# EasyEDA Pro project UpperMotor_v1_0_2.eprj

# Schematic Schematic1
Board Name: Board1; Create Date: 2025-05-16; Page Name: P1; Project Name: UpperMotor; Schematic Name: Schematic1; Update Date: 2025-05-17; Company: 嘉立创EDA; Drawed: 王大智; Page Size: A4; Version: V1.0
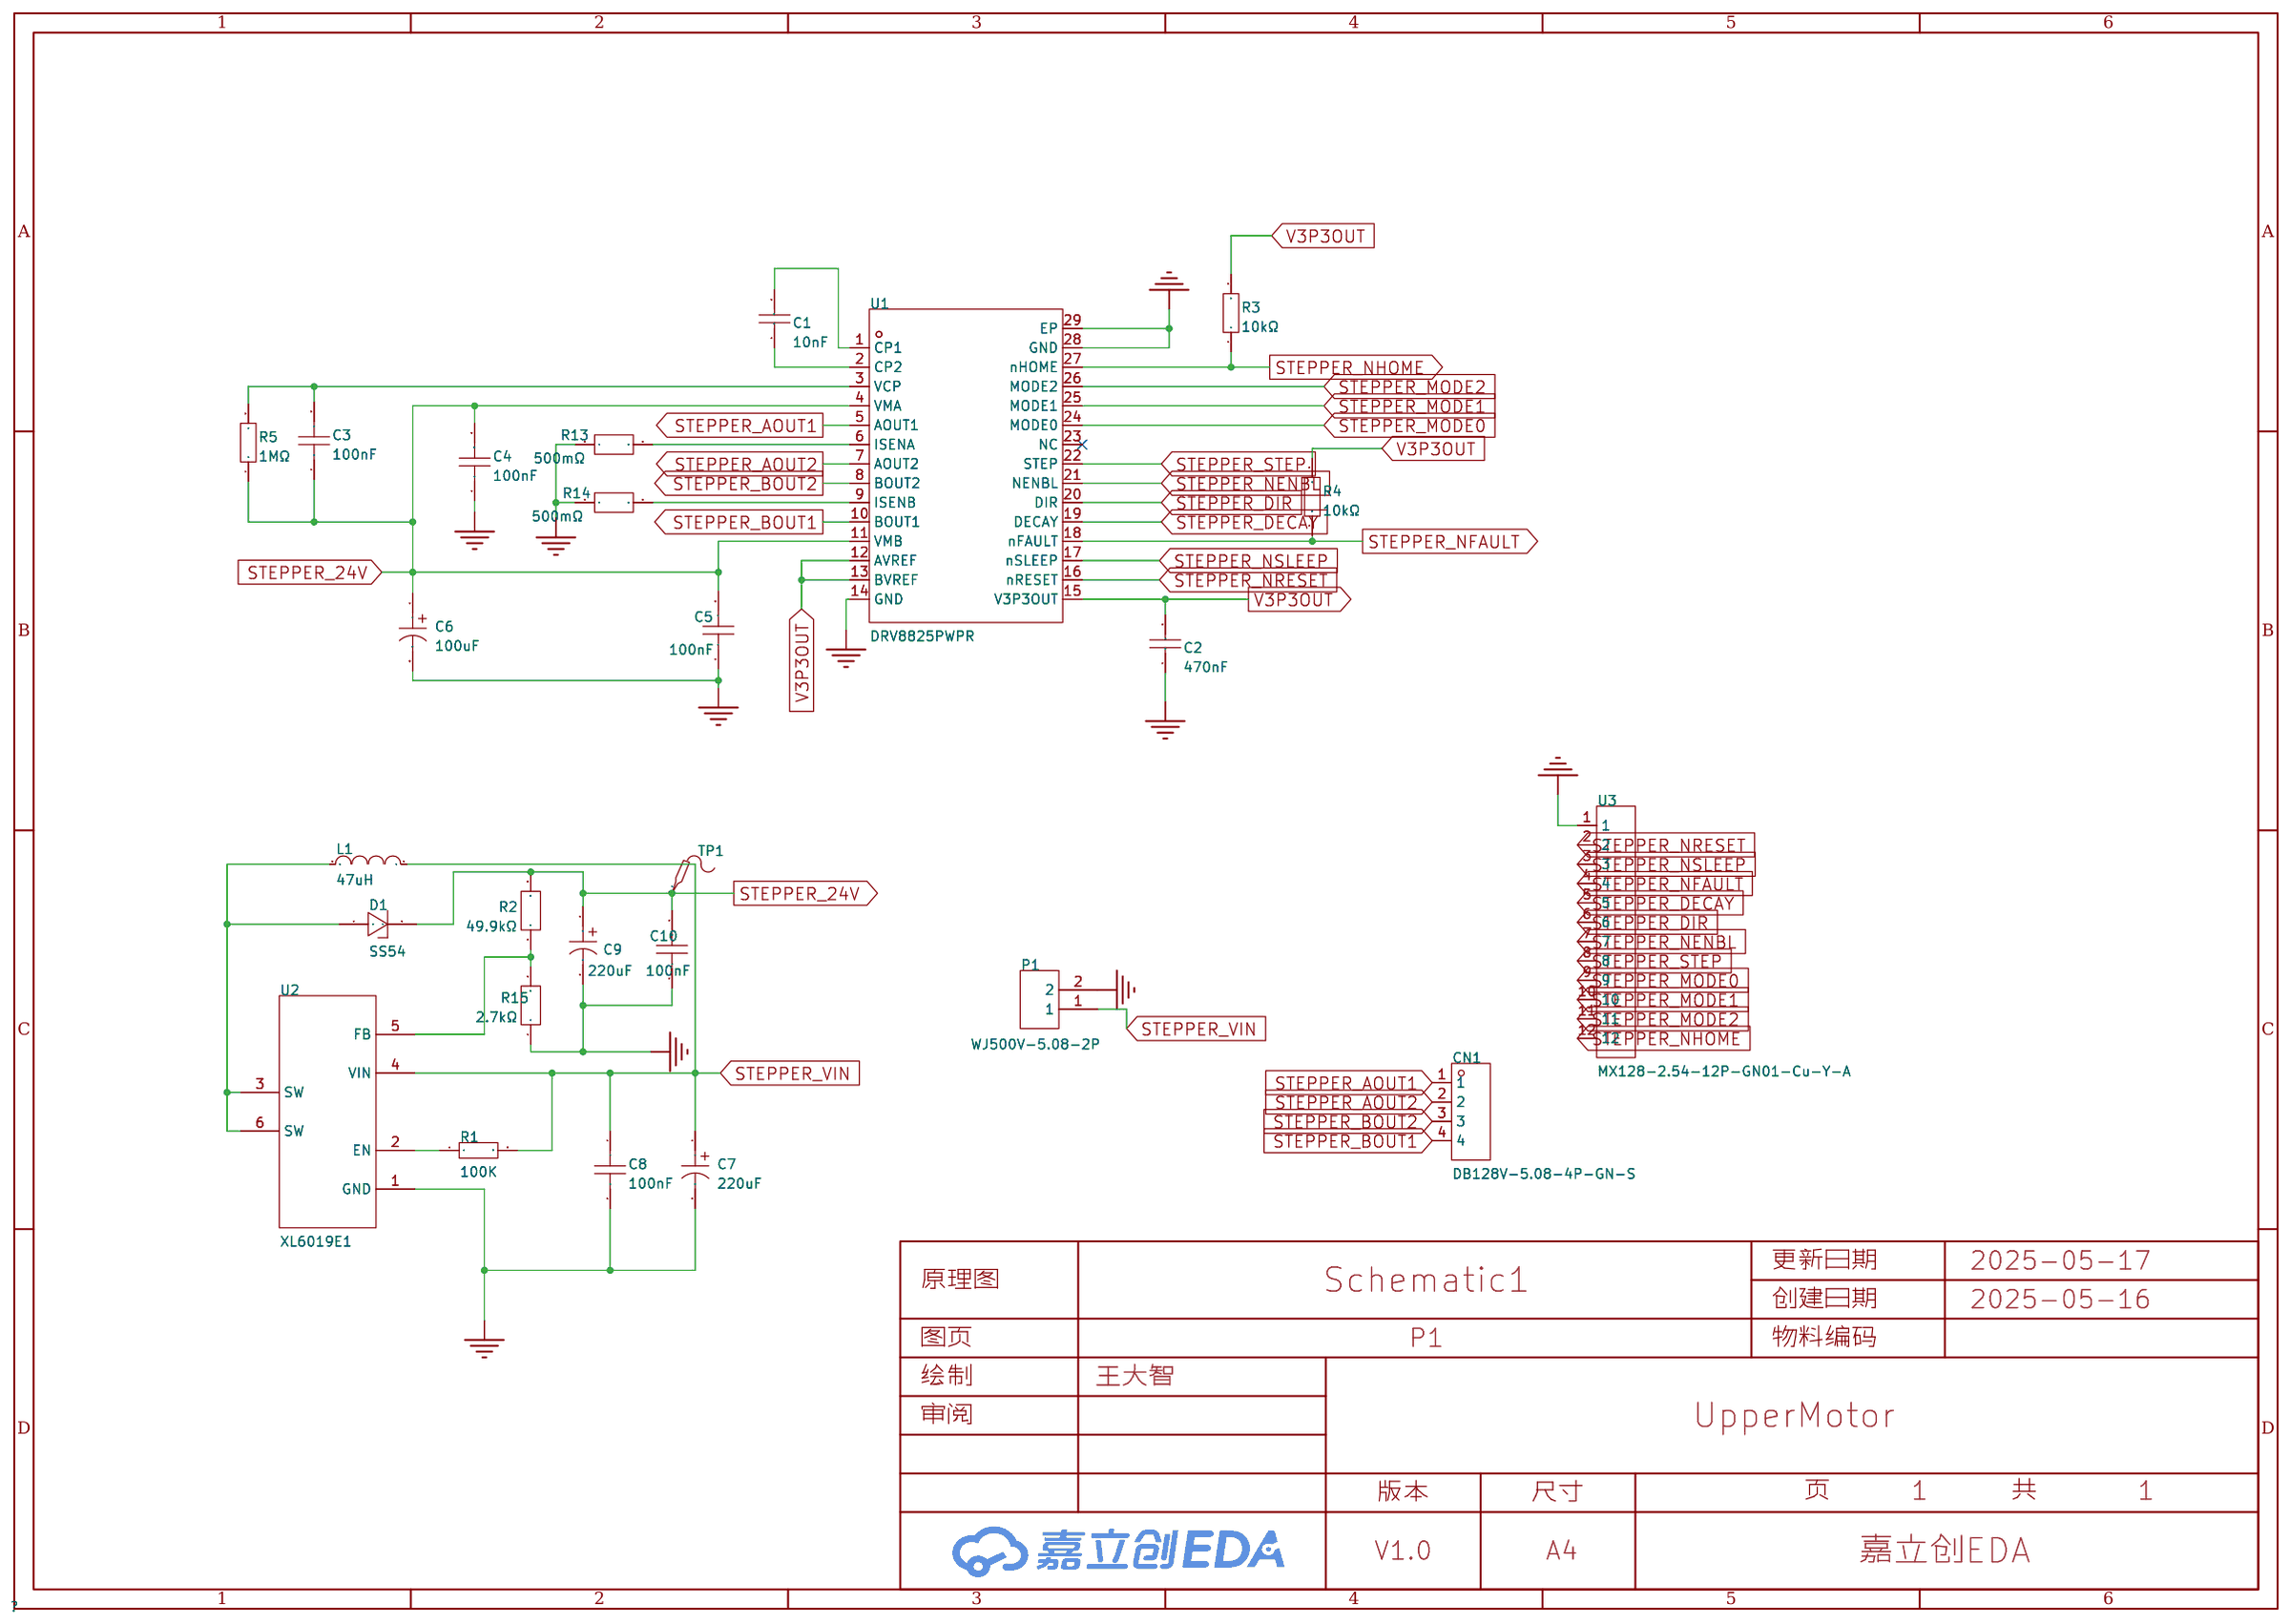
[diagram p0: schematic sheet]

## Parts
C1  10nF  [C0603]
C2  470nF  [C0603]
C3  100nF  [C0603]
C4  100nF  [C0603]
C5  100nF  [C0603]
C6  100uF  [CAP-SMD_BD8.1-L8.3-W8.3-LS9.3-FD]
C7  220uF  [CAP-SMD_BD8.0-L8.3-W8.3-FD]
C8  100nF  [C0603]
C9  220uF  [CAP-SMD_BD8.0-L8.3-W8.3-FD]
C10  100nF  [C0603]
CN1  DB128V-5.08-4P-GN-S  [CONN-TH_4P-P5.08_DIBO_DB128V-5.08]
D1  SS54  [SMA_L4.3-W2.6-LS5.0-FD]
L1  47uH  [IND-SMD_L11.5-W10.0_SMMS1040]
P1  WJ500V-5.08-2P  [CONN-TH_2P-P5.00_WJ500V-5.08-2P]
R1  100K  [R0603]
R2  49.9kΩ  [R0603]
R3  10kΩ  [R0603]
R4  10kΩ  [R0603]
R5  1MΩ  [R0603]
R13  500mΩ  [R0603]
R14  500mΩ  [R0603]
R15  2.7kΩ  [R0603]
TP1  -  [Test-Point-0.5mm]
U1  DRV8825PWPR  [HTSSOP-28_L9.7-W4.4-P0.65-LS6.4-BL-EP]
U2  XL6019E1  [TO-263-5_L10.2-W9.9-P1.70-LS14.4-TL]
U3  MX128-2.54-12P-GN01-Cu-Y-A  [CONN-TH_12P-P2.54_MX128-2.54-12P-GN01-CU-Y-A]

## Library data of the parts
C1 = CL10B103KB8NNNC: 容值:10nF;精度:±10%;额定电压:50V;材质(温度系数):X7R;; LCSC Part Name: 10nF ±10% 50V; Supplier Part: C1589; Manufacturer: SAMSUNG(三星); Supplier Footprint: 0603; JLCPCB Part Class: 扩展库; Datasheet: https://atta.szlcsc.com/upload/public/pdf/source/20160218/1457707763339.pdf; Supplier: LCSC; Tolerance: ±10%; Voltage Rated: 50V; Temperature Coefficient: X7R
C2 = CL10B474KA8NNNC: 容值:470nF;精度:±10%;额定电压:25V;材质(温度系数):X7R;; LCSC Part Name: 470nF ±10% 25V; Supplier Part: C1623; Manufacturer: SAMSUNG(三星); Supplier Footprint: 0603; JLCPCB Part Class: 基础库; Datasheet: https://atta.szlcsc.com/upload/public/pdf/source/20160218/1457707763339.pdf; Supplier: LCSC; Tolerance: ±10%; Voltage Rated: 25V; Temperature Coefficient: X7R
C3-C5 = CGA0603X7R104K500JT: 容值:100nF;精度:±10%;额定电压:50V;温度系数:X7R;; LCSC Part Name: 100nF ±10% 50V; Supplier Part: C6119867; Manufacturer: HRE(芯声); Supplier Footprint: 0603; JLCPCB Part Class: 扩展库; Datasheet: https://atta.szlcsc.com/upload/public/pdf/source/20250103/C44077DA9E7B3EFAE02F22B6D3D1CBC9.pdf; Supplier: LCSC; Tolerance: ±10%; Voltage Rating: 50V; Temperature Coefficient: X7R
C6 = GVE1H107M0810CNVC: 容值:100uF;精度:±20%;额定电压:50V;纹波电流:300mA@100kHz;等效串联电阻:600mΩ@100kHz;; LCSC Part Name: 100uF ±20% 50V; Supplier Part: C2983307; Manufacturer: HRK(鸿瑞凯电子); Supplier Footprint: SMD,D8xL10.5mm; JLCPCB Part Class: 扩展库; Datasheet: https://atta.szlcsc.com/upload/public/pdf/source/20220321/B5A059027F69866A3EEEBC781A889613.pdf; Supplier: LCSC; Tolerance: ±20%; Rated Voltage: 50V; Ripple Current: 300mA@100kHz; Equivalent Series Resistance(ESR): 600mΩ@100kHz; φD: 8mm; L: 10.5mm; Lifetime @ Temp: 2000hrs@105℃; Operating Temperature: -55℃~+105℃
C7 C9 = GVT1V227M0810CNVC: 容值:220uF;精度:±20%;额定电压:35V;纹波电流:175mA@120Hz;; LCSC Part Name: 220uF ±20% 35V; Supplier Part: C2983323; Manufacturer: HRK(鸿瑞凯电子); Supplier Footprint: SMD,D8xL10.5mm; JLCPCB Part Class: 扩展库; Datasheet: https://atta.szlcsc.com/upload/public/pdf/source/20220321/BA17E910A44EA2B508CDD6AB8BA576BA.pdf; Supplier: LCSC; Tolerance: ±20%; Rated Voltage: 35V; Ripple Current: 175mA@120Hz; φD: 8mm; L: 10.5mm; Lifetime @ Temp: 2000hrs@105℃; Operating Temperature: -55℃~+105℃
C8 C10 = CAP_0603: Supplier Footprint: 0603
CN1 = DB128V-5.08-4P-GN-S: 结构:1x4P;间距:5.08mm;颜色:绿色;安装方式:直插;排数:1;每排PIN数:4;额定电流:16A;额定电压:300V;线规 - AWG:12~22;线规 - 平方毫米:2.5;工作温度:-40℃~+105℃;; LCSC Part Name: 1x4P 5.08mm 直插 排数:1 每排P数:4; Supplier Part: C2915641; Manufacturer: DORABO(地博电气); Supplier Footprint: 插件,P=5.08mm; JLCPCB Part Class: 扩展库; Datasheet: https://atta.szlcsc.com/upload/public/pdf/source/20230106/CC449C10514519CDCE20F1C37DBF2DAC.pdf; Supplier: LCSC; Number of Positions or Pins: 1x4P; Pitch: 5.08mm; Color: 绿色; Mounting Type: 直插; Number of Pins: 4P; Number of Rows: 1; Number of PINs Per Row: 4; Screw Specification: M2.5; Current Rating: 16A; Voltage Rating (Max): 300V; Wire Gauge - AWG: 12~22; Wire Gauge - mm2: 2.5; Operating Temperature: -40℃~+105℃
D1 = SS54_C7420369: 二极管配置:独立式;正向压降(Vf):550mV@5.0A;直流反向耐压(Vr):40V;整流电流:5A;; LCSC Part Name: 电压:40V 电流:5A; Supplier Part: C7420369; Manufacturer: 宏迦橙; Supplier Footprint: SMA(DO-214AC); JLCPCB Part Class: 扩展库; Datasheet: https://atta.szlcsc.com/upload/public/pdf/source/20230828/254C3882F8647358AD9F60DD73611B5E.pdf; Supplier: LCSC; Diode Configuration: 独立式; Forward Voltage (Vf@If): 550mV@5.0A; Reverse Voltage (Vr): 40V; Rectified Current: 5A; Reverse Leakage Current (Ir): 50uA@40V
L1 = SMMS1040-470M: 电感值:47uH;精度:±20%;额定电流:3A;饱和电流(Isat):4.5A;类型:一体成型电感;; LCSC Part Name: 47uH ±20% 4.5A; Supplier Part: C149599; Manufacturer: SXN(顺翔诺); JLCPCB Part Class: 扩展库; Datasheet: https://atta.szlcsc.com/upload/public/pdf/source/20210810/BBF24330FB2F5029F637830BA9C42C0D.pdf; Supplier: LCSC; Tolerance: ±20%; Rated Current: 3A; Saturation Current (Isat): 4.5A; DC Resistance (DCR): 155mΩ; Type: 一体成型电感
P1 = WJ500V-5.08-2P: 结构:1x2P;间距:5.08mm;颜色:绿色;安装方式:直插;额定电流:18A;额定电压:250V;排数:1;线规 - AWG:14~30;线规 - 平方毫米:2.5;每排PIN数:2;触头材质:-;触头镀层:-;工作温度范围:-40℃~+105℃;焊接温度(最大值):-;; LCSC Part Name: 1x2P 5.08mm 直插 排数:1 每排P数:2; Supplier Part: C8465; Manufacturer: KANGNEX(康奈克斯电气); Supplier Footprint: 插件,P=5.08mm; JLCPCB Part Class: 扩展库; Datasheet: https://atta.szlcsc.com/upload/public/pdf/source/20191225/C8465_02D34CE5B5B4A53DF5891601D97FA9F4.pdf; Supplier: LCSC; Structure: 1x2P; Pitch: 5.08mm; Color: 绿色; Mounting Style: 直插; Current Rating (Max): 18A; Voltage Rating (Max): 250V; Number of Pins: 2P; Number of Rows: 1; Wire Gauge - AWG: 14~30; Wire Gauge - mm2: 2.5; Number of PINs Per Row: 2; Operating Temperature Range: -40℃~+105℃; Screw Specification: M2.5
R1 = Res_0603: Supplier Footprint: 0603
R2 = FRC0603F4992TS: 电阻类型:厚膜电阻;阻值:49.9kΩ;精度:±1%;功率:100mW;最大工作电压:75V;温度系数:±100ppm/℃;; LCSC Part Name: 49.9kΩ ±1% 100mW 厚膜电阻; Supplier Part: C2930109; Manufacturer: FOJAN(富捷); Supplier Footprint: 0603; JLCPCB Part Class: 扩展库; Datasheet: https://atta.szlcsc.com/upload/public/pdf/source/20211221/925EC7D7225764EE0046F22065062C87.pdf; Supplier: LCSC; Type: 厚膜电阻; Tolerance: ±1%; Power(Watts): 100mW; Overload Voltage (Max): 75V; Temperature Coefficient: ±100ppm/℃; Operating Temperature Range: -55℃~+155℃
R3 R4 = RC0603FR-0710KL: 电阻类型:厚膜电阻;阻值:10kΩ;精度:±1%;功率:100mW;最大工作电压:75V;温度系数:±100ppm/℃;; LCSC Part Name: 厚膜电阻 10kΩ ±1% 100mW; Supplier Part: C98220; Manufacturer: YAGEO(国巨); Supplier Footprint: 0603; JLCPCB Part Class: 扩展库; Datasheet: https://atta.szlcsc.com/upload/public/pdf/source/20180927/C295883_E8D83085EA81BD7DE0B2B681138C15EE.pdf; Supplier: LCSC; Type: 厚膜电阻; Tolerance: ±1%; Power(Watts): 100mW; Overload Voltage (Max): 75V; Temperature Coefficient: ±100ppm/℃; Operating Temperature Range: -55℃~+155℃
R5 = 0603WAF1004T5E: 电阻类型:厚膜电阻;阻值:1MΩ;精度:±1%;功率:100mW;最大工作电压:75V;温度系数:±100ppm/℃;; LCSC Part Name: 1MΩ ±1% 100mW 厚膜电阻; Supplier Part: C22935; Manufacturer: UNI-ROYAL(厚声); Supplier Footprint: 0603; JLCPCB Part Class: Basic Part; Datasheet: https://atta.szlcsc.com/upload/public/pdf/source/20200306/C422600_1E6D84923E4A46A82E41ADD87F860B5C.pdf; Supplier: LCSC; Type: 厚膜电阻; Tolerance: ±1%; Power(Watts): 100mW; Overload Voltage (Max): 75V; Temperature Coefficient: ±100ppm/℃; Operating Temperature Range: -55℃~+155℃
R13 R14 = FRL0603JR500TS: 电阻类型:厚膜电阻;阻值:500mΩ;精度:±5%;功率:100mW;最大工作电压:100V;温度系数:±300ppm/℃;; LCSC Part Name: 500mΩ ±5% 100mW 厚膜电阻; Supplier Part: C2930046; Manufacturer: FOJAN(富捷); Supplier Footprint: 0603; JLCPCB Part Class: 扩展库; Datasheet: https://atta.szlcsc.com/upload/public/pdf/source/20211221/925EC7D7225764EE0046F22065062C87.pdf; Supplier: LCSC; Type: 厚膜电阻; Tolerance: ±5%; Power(Watts): 100mW; Overload Voltage (Max): 100V; Temperature Coefficient: ±300ppm/℃; Operating Temperature Range: -55℃~+155℃
R15 = FRC0603F2701TS: 电阻类型:厚膜电阻;阻值:2.7kΩ;精度:±1%;功率:100mW;工作电压:75V;温度系数:±100ppm/℃;; LCSC Part Name: 2.7kΩ ±1% 100mW 厚膜电阻; Supplier Part: C2907008; Manufacturer: FOJAN(富捷); Supplier Footprint: 0603; JLCPCB Part Class: 扩展库; Datasheet: https://atta.szlcsc.com/upload/public/pdf/source/20211221/925EC7D7225764EE0046F22065062C87.pdf; Supplier: LCSC; Type: 厚膜电阻; Tolerance: ±1%; Power(Watts): 100mW; Voltage-Supply(Max): 75V; Temperature Coefficient: ±100ppm/℃; Operating Temperature: -55℃~+155℃
TP1 = Test-Point: Test Point 测试点
U1 = DRV8825PWPR: DRV8825 具有电流调节功能和 1/32 微步进的 45V、2.5A 双极步进电机驱动器; LCSC Part Name: 2.5A 45V电机驱动芯片; Supplier Part: C81582; Manufacturer: TI(德州仪器); Supplier Footprint: HTSSOP-28-EP; JLCPCB Part Class: 扩展库; Datasheet: https://www.ti.com/cn/lit/gpn/drv8825; Supplier: LCSC
U2 = XL6019E1: 功能类型:升降压型;输出类型:可调;工作电压:5V~40V;输出电压:-;输出电流:5A;; LCSC Part Name: 180KHz 60V 5A开关电流升压/升降压型DC-DC转换器; Supplier Part: C73018; Manufacturer: XLSEMI(芯龙); Supplier Footprint: TO-263-5; JLCPCB Part Class: 扩展库; Datasheet: https://atta.szlcsc.com/upload/public/pdf/source/20230915/0F37A40A07D65557F92F701F29EBE038.pdf; Supplier: LCSC; Function: 升降压型; Output Type: 可调; Input Voltage: 5V~40V; Output Current: 5A; Switching Frequency: 180kHz; Operating Temperature: -40℃~+125℃; Synchronous Rectification: 是; Number of Outputs: 1; Topology: 反相式; Quiescent Current (Iq): 2.5mA; Switch tube (built-in/external): 内置
U3 = MX128-2.54-12P-GN01-Cu-Y-A: 结构:1x12P;间距:2.54mm;颜色:绿色;安装方式:直插;排数:1;每排PIN数:12;额定电流:6A;额定电压:150V;线规 - AWG:18~24;线规 - 平方毫米:1;工作温度:-40℃~+105℃;; LCSC Part Name: 1x12P 2.54mm 直插 排数:1 每排P数:12; Supplier Part: C5188451; Manufacturer: MAX(迈旭); Supplier Footprint: 插件,P=2.54mm; JLCPCB Part Class: 扩展库; Datasheet: https://atta.szlcsc.com/upload/public/pdf/source/20250320/39CF67EAC718F5AC600D0D1AE915BA0E.pdf; Supplier: LCSC; Number of Positions or Pins: 1x12P; Pitch: 2.54mm; Color: 绿色; Mounting Type: 直插; Number of Pins: 12P; Number of Rows: 1; Number of PINs Per Row: 12; Screw Specification: M1.6; Current Rating: 6A; Voltage Rating (Max): 150V; Wire Gauge - AWG: 18~24; Wire Gauge - mm2: 1; Operating Temperature: -40℃~+105℃

## Nets
GND: C2.1 C4.1 C5.1 C6.2 C7.2 C8.2 C9.2 C10.1 P1.2 R13.1 R14.1 R15.1 U1.14(GND) U1.28(GND) U1.29(EP) U2.1(GND) U3.1
V3P3OUT: C2.2 R3.2 R4.2 U1.12(AVREF) U1.13(BVREF) U1.15(V3P3OUT)
STEPPER_24V: C3.1 C4.2 C5.2 C6.1 C9.1 C10.2 D1.2(K) R2.2 R5.1 TP1.1 U1.4(VMA) U1.11(VMB)
STEPPER_AOUT1: CN1.1 U1.5(AOUT1)
STEPPER_AOUT2: CN1.2 U1.7(AOUT2)
STEPPER_BOUT1: CN1.4 U1.10(BOUT1)
STEPPER_BOUT2: CN1.3 U1.8(BOUT2)
STEPPER_DECAY: U1.19(DECAY) U3.5
STEPPER_DIR: U1.20(DIR) U3.6
STEPPER_MODE0: U1.24(MODE0) U3.9
STEPPER_MODE1: U1.25(MODE1) U3.10
STEPPER_MODE2: U1.26(MODE2) U3.11
STEPPER_NENBL: U1.21(NENBL) U3.7
STEPPER_NFAULT: R4.1 U1.18(nFAULT) U3.4
STEPPER_NHOME: R3.1 U1.27(nHOME) U3.12
STEPPER_NRESET: U1.16(nRESET) U3.2
STEPPER_NSLEEP: U1.17(nSLEEP) U3.3
STEPPER_STEP: U1.22(STEP) U3.8
STEPPER_VIN: C7.1 C8.1 L1.2 P1.1 R1.2 U2.4(VIN)
$1N829: C1.1 U1.2(CP2)
$1N830: C1.2 U1.1(CP1)
$1N833: R13.2 U1.6(ISENA)
$1N834: R14.2 U1.9(ISENB)
$1N856: C3.2 R5.2 U1.3(VCP)
$1N1708: R1.1 U2.2(EN)
$1N1709: R2.1 R15.2 U2.5(FB)
$1N1711: D1.1(A) L1.1 U2.3(SW) U2.6(SW)

Not connected (* = marked no-connect by the designer): U1 23(NC)*

# Board PCB1
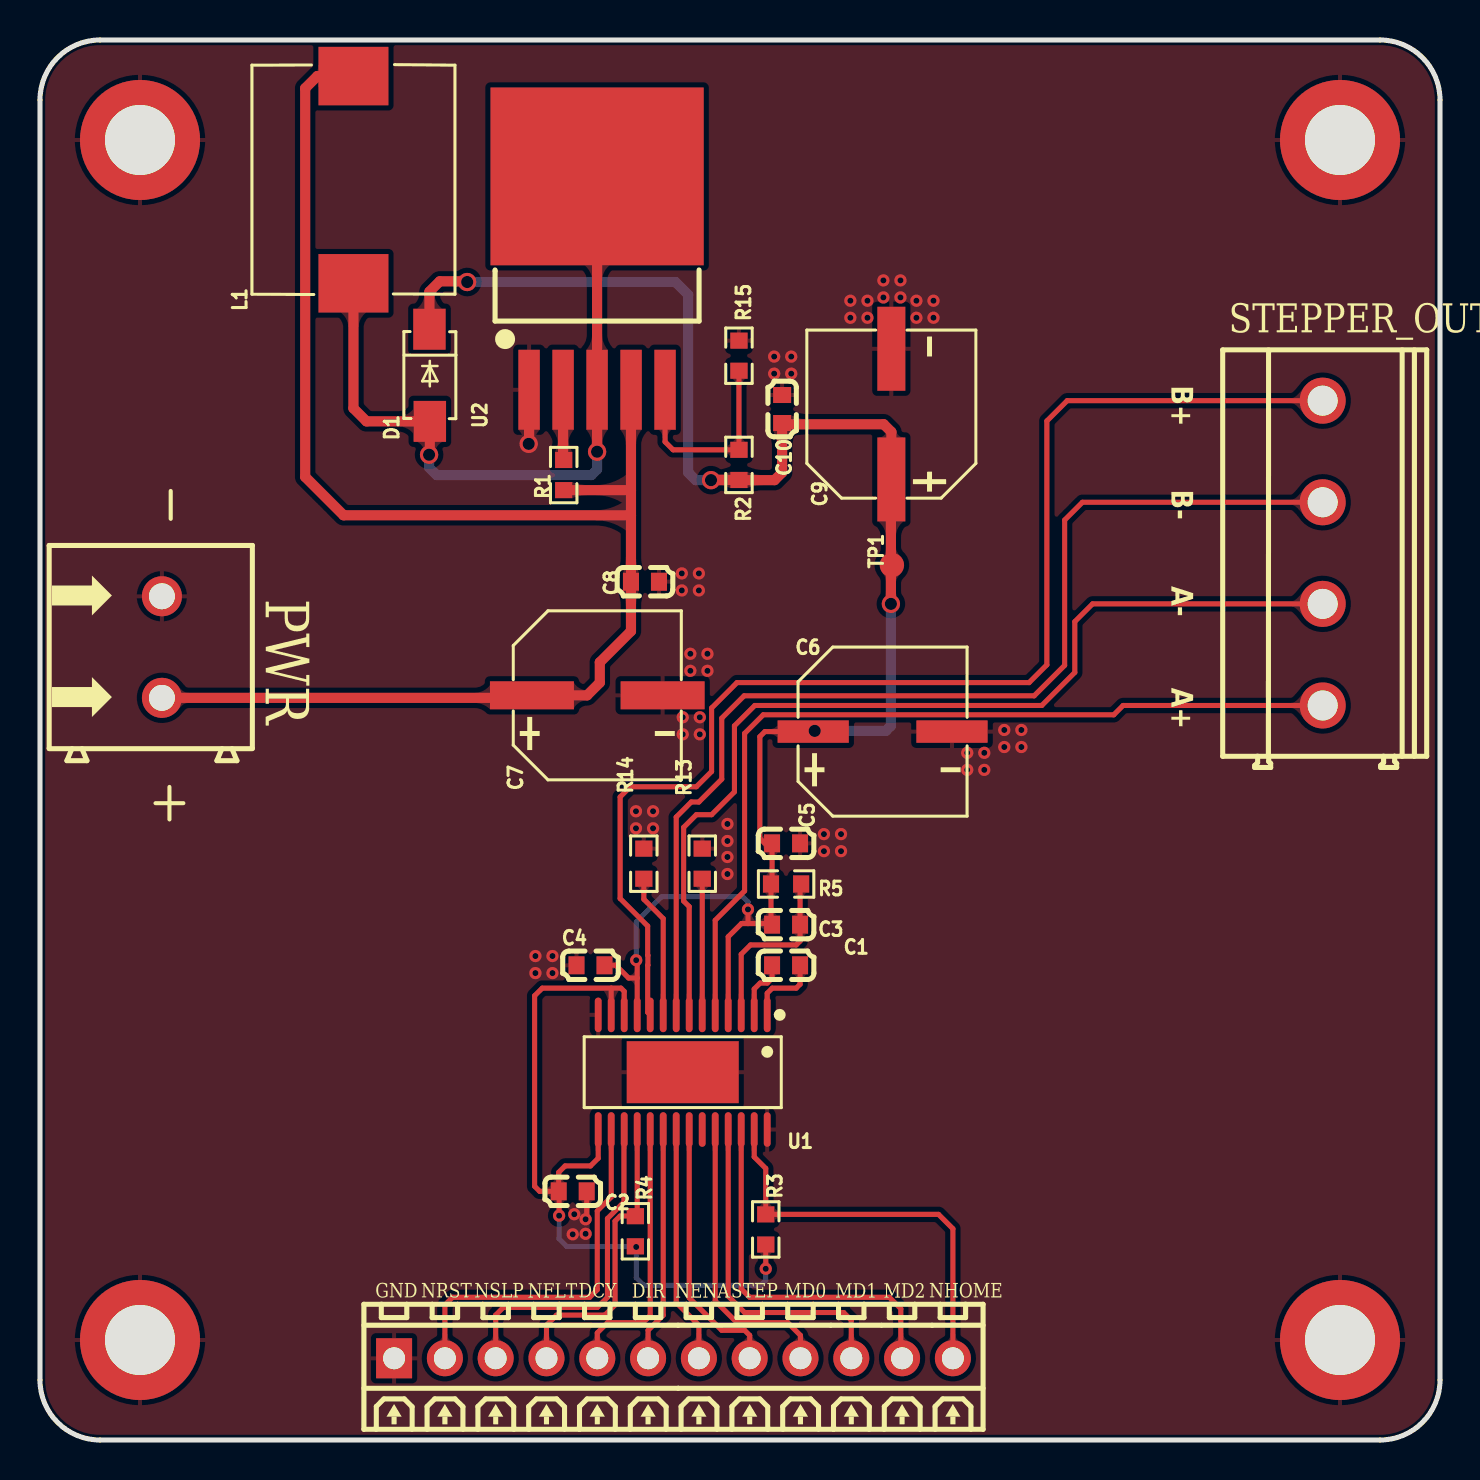
[diagram p1: board, top side]
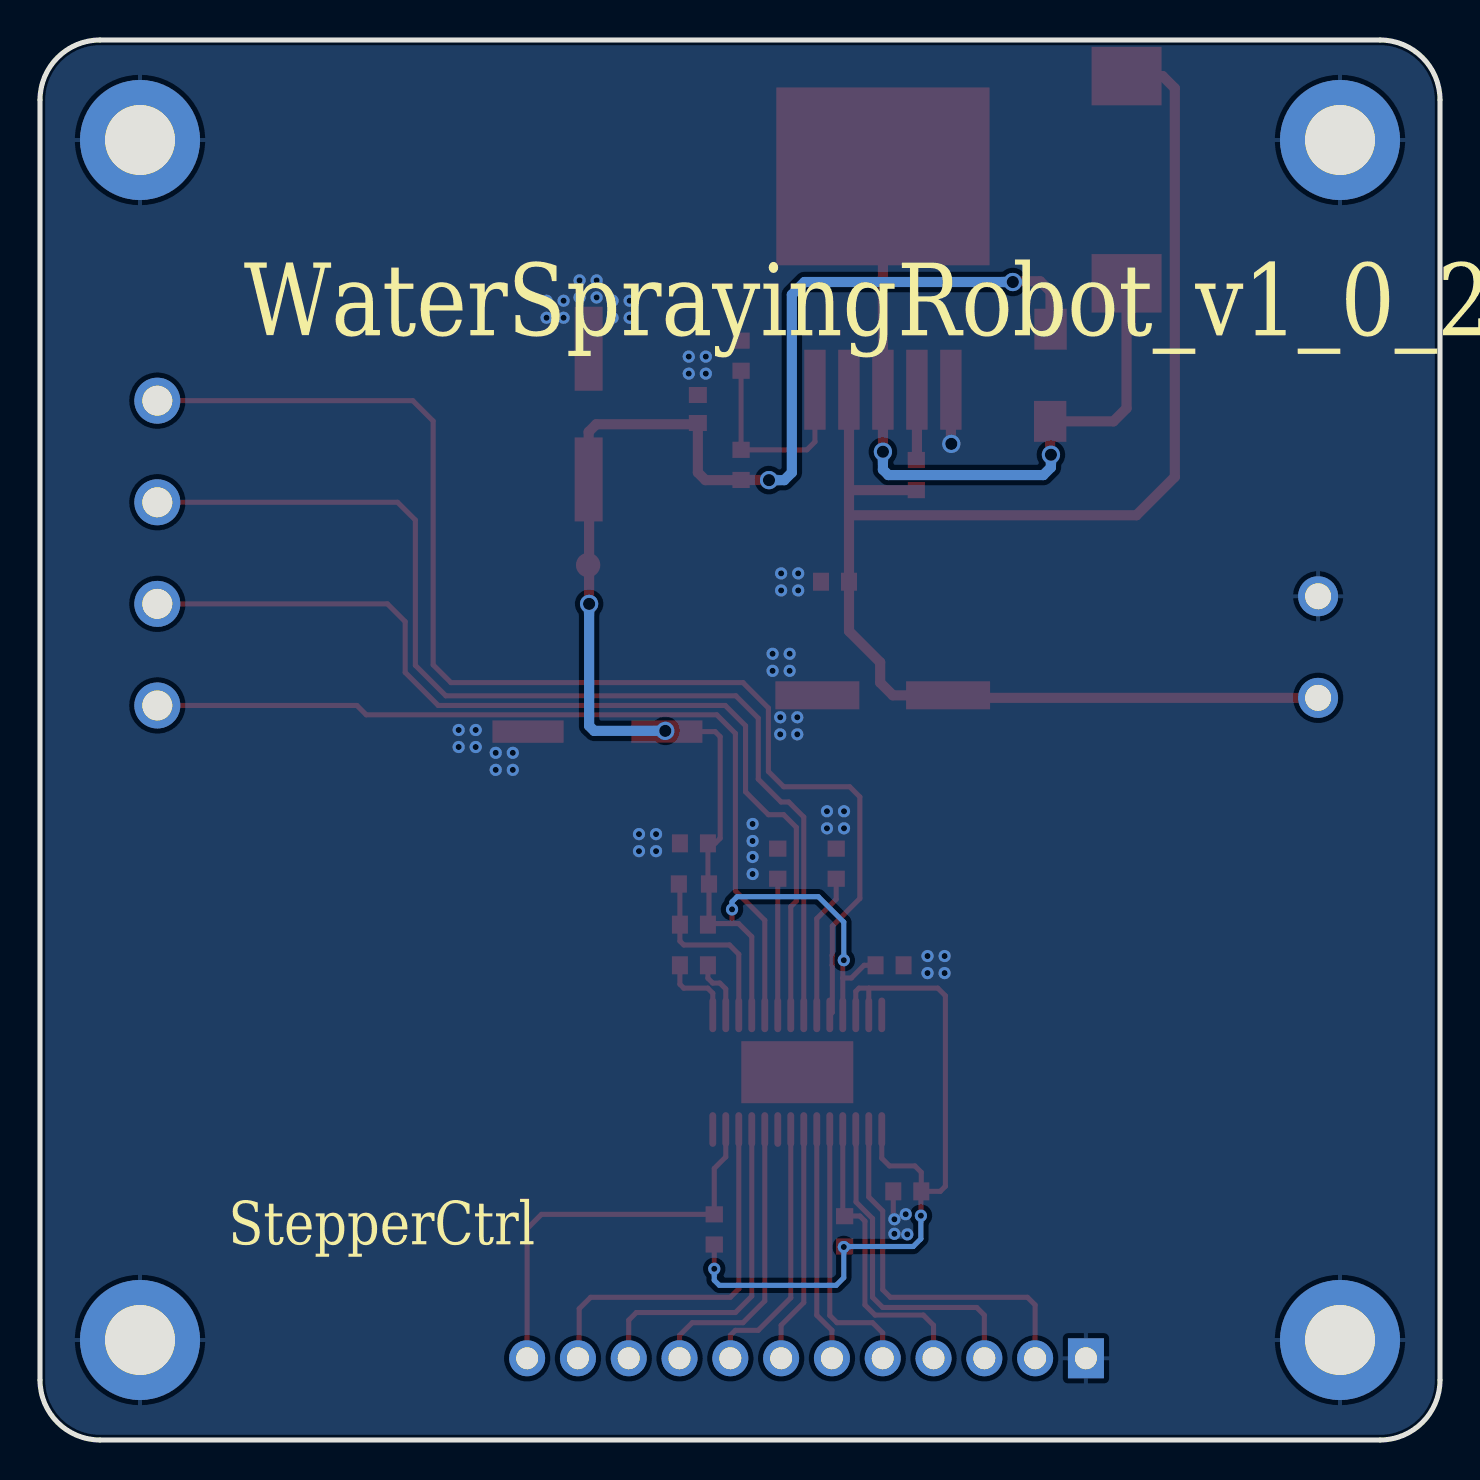
[diagram p2: board, bottom side, seen from below]

Outline 70 x 70 mm; copper layers: Top Layer, Bottom Layer. Coordinates in mm from the lower left corner of the outline.
Outline path: 0,67 0,3 arc(0.88,0.88) 3,0 67,0 arc(69.12,0.88) 70,3 70,67 arc(69.12,69.12) 67,70 3,70 arc(0.88,69.12) 0,67
Stack: Top Layer 0.035mm / Dielectric1 1.51mm FR4 er 4.5 / Bottom Layer 0.035mm

## Design rules (mm)
template: JLCPCB Capability(Two Layers Board)
spacing copperThickness1oz (default): track to track 0.102, other pairs 0.152 to 0.3
spacing copperThickness2oz: track to track 0.203, other pairs 0.152 to 0.3
track width copperThickness1oz (default): min 0.127, default 0.254, max 2.54
track width copperThickness2oz: min 0.203, default 0.254, max 2.54
differential pair differentialPair (default): width min 0.127, default 0.254, max 2.54; gap min 0.152, default 0.152
via viaSize (default): diameter min 0.5, default 0.61, max 10; hole min 0.3, default 0.305, max 6.3

## Placement (name value [footprint] x y rotation side)
C1  10nF  [C0603]  37.3 23.74 0 top
C2  470nF  [C0603]  26.64 12.43 180 top
C3  100nF  [C0603]  37.3 25.77 0 top
C4  100nF  [C0603]  27.52 23.74 0 top
C5  100nF  [C0603]  37.3 29.83 180 top
C6  100uF  [CAP-SMD_BD8.1-L8.3-W8.3-LS9.3-FD]  42.13 35.42 0 top
C7  220uF  [CAP-SMD_BD8.0-L8.3-W8.3-FD]  27.86 37.23 0 top
C8  100nF  [C0603]  30.25 42.91 0 top
C9  220uF  [CAP-SMD_BD8.0-L8.3-W8.3-FD]  42.57 51.3 90 top
C10  100nF  [C0603]  37.11 51.55 270 top
CN1  DB128V-5.08-4P-GN-S  [CONN-TH_4P-P5.08_DIBO_DB128V-5.08]  64.13 44.35 90 top
D1  SS54  [SMA_L4.3-W2.6-LS5.0-FD]  19.48 53.24 90 top
L1  47uH  [IND-SMD_L11.5-W10.0_SMMS1040]  15.67 63.02 90 top
NOREF  -  [Pad_e732]  5 65 0 top
NOREF#2  -  [Pad_e764]  5 5 0 top
NOREF#3  -  [Pad_e765]  65 5 0 top
NOREF#4  -  [Pad_e763]  65 65 0 top
P1  WJ500V-5.08-2P  [CONN-TH_2P-P5.00_WJ500V-5.08-2P]  6.1 39.65 90 top
R1  100K  [R0603]  26.18 48.25 270 top
R2  49.9kΩ  [R0603]  34.95 48.75 270 top
R3  10kΩ  [R0603]  36.29 10.53 270 top
R4  10kΩ  [R0603]  29.77 10.44 270 top
R5  1MΩ  [R0603]  37.3 27.8 0 top
R13  500mΩ  [R0603]  33.11 28.82 270 top
R14  500mΩ  [R0603]  30.19 28.82 270 top
R15  2.7kΩ  [R0603]  34.95 54.22 270 top
TP1  -  [Test-Point-0.5mm]  42.59 43.75 90 top
U1  DRV8825PWPR  [HTSSOP-28_L9.7-W4.4-P0.65-LS6.4-BL-EP]  32.14 18.39 180 top
U2  XL6019E1  [TO-263-5_L10.2-W9.9-P1.70-LS14.4-TL]  27.85 57.85 90 top
U3  MX128-2.54-12P-GN01-Cu-Y-A  [CONN-TH_12P-P2.54_MX128-2.54-12P-GN01-CU-Y-A]  31.67 4.09 0 top

## Footprints (pads in the part's own frame, mm; a bottom-side part is the same pattern mirrored in y, then rotated)
C0603
  rect 0.8x0.9 smd: 1(-0.7,0) 2(0.7,0)
CAP-SMD_BD8.0-L8.3-W8.3-FD
  rect 4.2x1.4 smd: 1(-3.267,0) 2(3.267,0)
CAP-SMD_BD8.1-L8.3-W8.3-LS9.3-FD
  rect 3.56x1.12 smd: 1(-3.47,0) 2(3.47,0)
CONN-TH_2P-P5.00_WJ500V-5.08-2P
  round 2 hole 1.3: 1(-2.54,0) 2(2.54,0)
CONN-TH_4P-P5.08_DIBO_DB128V-5.08
  round 2.3 hole 1.5: 1(-7.62,0) 2(-2.54,0) 3(2.54,0) 4(7.62,0)
CONN-TH_12P-P2.54_MX128-2.54-12P-GN01-CU-Y-A
  rect 1.8x2 hole 1.1: 1(-13.97,0)
  round 1.8 hole 1.1: 2(-11.43,0) 3(-8.89,0) 4(-6.35,0) 5(-3.81,0) 6(-1.27,0) 7(1.27,0) 8(3.81,0) 9(6.35,0) 10(8.89,0) 11(11.43,0) 12(13.97,0)
HTSSOP-28_L9.7-W4.4-P0.65-LS6.4-BL-EP
  oval 0.343x1.732 smd: 1(-4.225,-2.866) 2(-3.575,-2.866) 3(-2.925,-2.866) 4(-2.275,-2.866) 5(-1.625,-2.866) 6(-0.975,-2.866) 7(-0.325,-2.866) 8(0.325,-2.866) 9(0.975,-2.866) 10(1.625,-2.866) 11(2.275,-2.866) 12(2.925,-2.866) 13(3.575,-2.866) 14(4.225,-2.866) 15(4.225,2.866) 16(3.575,2.866) 17(2.925,2.866) 18(2.275,2.866) 19(1.625,2.866) 20(0.975,2.866) 21(0.325,2.866) 22(-0.325,2.866) 23(-0.975,2.866) 24(-1.625,2.866) 25(-2.275,2.866) 26(-2.925,2.866) 27(-3.575,2.866) 28(-4.225,2.866)
  rect 5.6x3.1 smd: 29(0,0)
IND-SMD_L11.5-W10.0_SMMS1040
  rect 2.924x3.5 smd: 1(-5.181,0) 2(5.181,0)
Pad_e732
  round 6 hole 3.5: 1(0,0)
Pad_e763
  round 6 hole 3.5: 1(0,0)
Pad_e764
  round 6 hole 3.5: 1(0,0)
Pad_e765
  round 6 hole 3.5: 1(0,0)
R0603
  rect 0.806x0.864 smd: 1(-0.753,0) 2(0.753,0)
SMA_L4.3-W2.6-LS5.0-FD
  rect 2.046x1.62 smd: 1(-2.304,-0.009) 2(2.304,0.009)
Test-Point-0.5mm
  round 1.219 smd: 1(0,0)
TO-263-5_L10.2-W9.9-P1.70-LS14.4-TL
  rect 4x1.069 smd: 1(-5.334,3.4) 2(-5.334,1.7) 3(-5.334,0) 4(-5.334,-1.7) 5(-5.334,-3.4)
  rect 8.89x10.66 smd: 6(5.334,0)

## Nets
As in the schematic, except:
GND: C2.1 C4.1 C5.1 C6.2 C7.2 C8.2 C9.2 C10.1 NOREF.1 NOREF#2.1 NOREF#3.1 NOREF#4.1 P1.2 R13.1 R14.1 R15.1 U1.14 U1.28 U1.29 U2.1 U3.1

Pads without a net: U1 23

## Via types
v1: diameter 0.61, hole 0.305, Top Layer to Bottom Layer, 61 vias
v2: diameter 0.914, hole 0.61, Top Layer to Bottom Layer, 7 vias

## Routing (per net, layer and track width the routed paths; a pad name or vN(x,y) marks a point on that pad's centre or on a via; arc(x,y) is an arc through that point)
GND: length 4.1
  Top Layer w0.254: C2.1 27.34,11.09 v1(27.28,11.04)
  Top Layer w0.508: U2.1 24.45,49.83 v2(24.44,49.81)
  vias: v1(24.77,24.2) v1(24.77,23.35) v1(25.62,24.2) v1(25.62,23.35) v1(26.64,10.28) v1(26.71,11.29) v1(27.28,10.31) v1(29.8,31.44) v1(29.8,30.58) v1(30.65,31.44) v1(30.65,30.58) v1(32.09,43.33) v1(32.09,42.48) v1(32.14,36.14) v1(32.14,35.28) v1(32.52,39.31) v1(32.52,38.46) v1(32.94,43.33) v1(32.94,42.48) v1(32.99,36.14) v1(32.99,35.28) v1(33.37,39.31) v1(33.37,38.46) v1(34.37,30.8) v1(34.37,29.95) v1(34.37,29.15) v1(34.37,28.3) v1(36.71,54.17) v1(36.71,53.32) v1(37.56,54.17) v1(37.56,53.32) v1(39.2,30.29) v1(39.2,29.44) v1(40.05,30.29) v1(40.05,29.44) v1(40.52,56.96) v1(40.52,56.11) v1(41.37,56.96) v1(41.37,56.11) v1(42.17,57.98) v1(42.17,57.13) v1(43.02,57.98) v1(43.02,57.13) v1(43.82,56.96) v1(43.82,56.11) v1(44.67,56.96) v1(44.67,56.11) v1(46.36,34.36) v1(46.36,33.51) v1(47.21,34.36) v1(47.21,33.51) v1(48.21,35.5) v1(48.21,34.65) v1(49.07,35.5) v1(49.07,34.65)
V3P3OUT: length 39.2
  Top Layer w0.254: C2.2 25.94,13.38 26.25,13.7 27.52,13.7 27.91,14.09 U1.15 ; C2.2 25.96,12.41 v1(25.96,11.22) ; C2.2 24.98,12.43 24.73,12.69 24.73,22.21 25.11,22.59 29.05,22.59 29.21,22.43 29.21,21.26 ; U1.13 28.56,22.59 ; 36.29,9.78 v1(36.29,8.56) ; v1(29.81,9.65) 29.81,9.65
  Bottom Layer w0.254: v1(25.96,11.22) 25.96,10.06 26.34,9.68 29.79,9.68 v1(29.81,9.65) 29.81,8.12 30.19,7.73 36.03,7.73 36.29,7.99 v1(36.29,8.56)
STEPPER_24V: length 88.8
  Top Layer w0.254: 35.4,25.82 35.4,25.82 v1(35.4,26.53) ; 35.4,25.82 35.07,25.82 34.41,25.16 U1.4 ; 35.4,25.82 36.55,25.82 ; 29.86,23.1 29.43,23.1 28.79,23.74 C4.2 ; 29.86,23.1 U1.11 ; 29.86,23.1 29.86,23.94 v1(29.81,23.99) ; 36.55,25.82 R5.1 36.6,27.85 C5.2 36.25,29.83 35.99,30.09 35.99,35.17 36.25,35.42 C6.1 ; 36.55,25.82 C3.1
  Top Layer w0.508: v2(21.36,57.9) 21.32,57.94 19.99,57.94 19.47,57.42 19.47,55.54 ; v2(33.55,47.99) 33.56,48 R2.2 34.96,47.99 36.73,47.99 37.11,48.37 C10.2 37.17,50.79 42.19,50.79 42.57,50.41 C9.1 42.54,48.01 v2(42.54,41.81)
  Bottom Layer w0.254: v1(35.4,26.53) 35.4,26.91 35.14,27.17 31.08,27.17 29.81,25.89 v1(29.81,23.99)
  Bottom Layer w0.508: v2(42.54,41.81) 42.54,35.71 42.29,35.46 v2(38.74,35.46) ; v2(21.36,57.9) 31.77,57.9 32.41,57.26 32.41,48.37 32.79,47.99 v2(33.55,47.99)
STEPPER_AOUT1: length 44.2
  Top Layer w0.254: U1.5 33.76,25.99 35.23,27.45 35.23,35.33 36.16,36.26 53.69,36.26 54.15,36.73 CN1.1
STEPPER_AOUT2: length 49.5
  Top Layer w0.254: CN1.2 52.63,41.81 51.74,40.92 51.74,38.38 50.09,36.73 35.74,36.73 34.72,35.71 34.72,32.41 33.58,31.27 32.82,31.27 32.18,30.63 32.18,26.95 32.46,26.67 U1.7
STEPPER_BOUT1: length 63.9
  Top Layer w0.254: U1.10 30.38,21.38 30.38,23.74 30.39,23.75 30.39,24.23 30.38,24.24 30.38,25.7 29.01,27.07 29.01,32.15 29.51,32.66 32.82,32.66 33.58,33.42 33.58,36.6 34.85,37.87 49.45,37.87 50.34,38.76 50.34,50.95 51.36,51.97 CN1.4
STEPPER_BOUT2: length 54.8
  Top Layer w0.254: CN1.3 52.12,46.89 51.23,46 51.23,38.73 49.71,37.21 35.21,37.21 34.09,36.09 34.09,33.04 32.94,31.9 32.56,31.9 31.81,31.15 U1.8
STEPPER_DECAY: length 13.6
  Top Layer w0.254: U1.19 30.51,6.23 30.15,5.87 28.37,5.87 27.86,5.36 U3.5
STEPPER_DIR: length 11.8
  Top Layer w0.254: U3.6 30.4,5.48 31.16,6.24 U1.20
STEPPER_MODE0: length 14.7
  Top Layer w0.254: U1.24 33.76,6.95 34.85,5.87 37.39,5.87 38.02,5.23 U3.9
STEPPER_MODE1: length 16.9
  Top Layer w0.254: U1.25 34.41,7.19 35.23,6.37 40.18,6.37 40.56,5.99 U3.10
STEPPER_MODE2: length 18.9
  Top Layer w0.254: U1.26 35.06,7.56 35.48,7.13 42.47,7.13 43.04,6.56 43.04,4.15 U3.11
STEPPER_NENBL: length 11.9
  Top Layer w0.254: U1.21 31.81,6.87 32.94,5.74 U3.7
STEPPER_NFAULT: length 15.2
  Top Layer w0.254: U1.18 29.86,11.28 R4.1 29.76,11.2 29.01,11.2 28.75,10.94 28.75,6.75 28.25,6.25 25.83,6.25 25.32,5.74 U3.4
STEPPER_NHOME: length 20.6
  Top Layer w0.254: U3.12 45.64,10.56 44.93,11.28 R3.1 36.29,13.58 35.71,14.15 35.71,15.53
STEPPER_NRESET: length 18.9
  Top Layer w0.254: U3.2 20.24,6.75 20.62,7.13 27.48,7.13 27.86,7.52 27.86,11.45 28.56,12.15 28.56,15.52
STEPPER_NSLEEP: length 16.9
  Top Layer w0.254: 29.21,15.53 29.2,15.51 29.2,11.9 28.37,11.07 28.37,7.13 27.86,6.63 23.16,6.63 22.78,6.25 U3.3
STEPPER_STEP: length 13.4
  Top Layer w0.254: U1.22 32.46,7.11 34.09,5.48 35.23,5.48 35.48,5.23 U3.8
STEPPER_VIN: length 80
  Top Layer w0.508: 29.55,47.49 29.54,47.49 R1.2 ; 29.55,47.49 29.55,46.24 ; 29.55,47.49 29.55,52.51 U2.4 ; 29.55,46.24 C8.1 29.55,40.44 27.99,38.89 27.99,37.87 27.36,37.23 C7.1 24.47,37.11 P1.1 ; 29.55,46.24 15.18,46.24 13.26,48.16 13.26,67.59 13.87,68.2 L1.2
$1N829: length 3.1
  Top Layer w0.254: C1.1 36.6,23.08 36.37,22.85 36.01,22.85 35.71,22.55 35.71,21.26
$1N830: length 3.9
  Top Layer w0.254: U1.1 36.36,22.34 36.62,22.59 37.81,22.59 38,22.78 C1.2
$1N833: length 6.8
  Top Layer w0.254: 33.11,28.06 33.11,21.26
$1N834: length 7.2
  Top Layer w0.254: U1.9 31.16,26.07 30.19,27.04 30.19,28.06
$1N856: length 9.1
  Top Layer w0.254: 38.06,27.8 38,27.75 C3.2 38,24.94 37.81,24.75 35.53,24.75 35.06,24.29 U1.3
$1N1708: length 3.5
  Top Layer w0.508: R1.1 26.15,49.03 U2.2
$1N1709: length 10.4
  Top Layer w0.254: U2.5 31.25,49.91 31.65,49.51 R2.1 R15.2
$1N1711: length 36
  Top Layer w0.508: U2.6 U2.3 v2(27.85,49.41) ; L1.1 15.67,51.58 16.33,50.93 D1.1 19.49,49.3 v2(19.45,49.26)
  Bottom Layer w0.508: v2(27.85,49.41) 27.85,48.52 27.58,48.25 19.83,48.25 19.45,48.63 v2(19.45,49.26)

## Copper pours and planes (outline as drawn; the poured copper is in the pictures)
GND on Top Layer: -17.27,81.18 85.47,81.18 85.47,-10.26 -17.27,-10.26
GND on Bottom Layer: -6.22,76.48 76.33,76.48 76.33,-4.29 -6.22,-4.29

Small or netless copper shapes (teardrops, artwork), in the pictures only: 105 on Top Layer, 12 on Bottom Layer

## Text on the board
Bottom Silkscreen Layer: StepperCtrl | WaterSprayingRobot_v1_0_2
Top Silkscreen Layer: + | - | B+ | B- | A- | A+ | STEPPER_OUT | PWR | GND | NRST | NSLP | NFLT | DCY | DIR | NENA | STEP | MD0 | MD1 | MD2 | NHOME
